# EAGLE board clonos (EAGLE 6.4), part 1 of 2
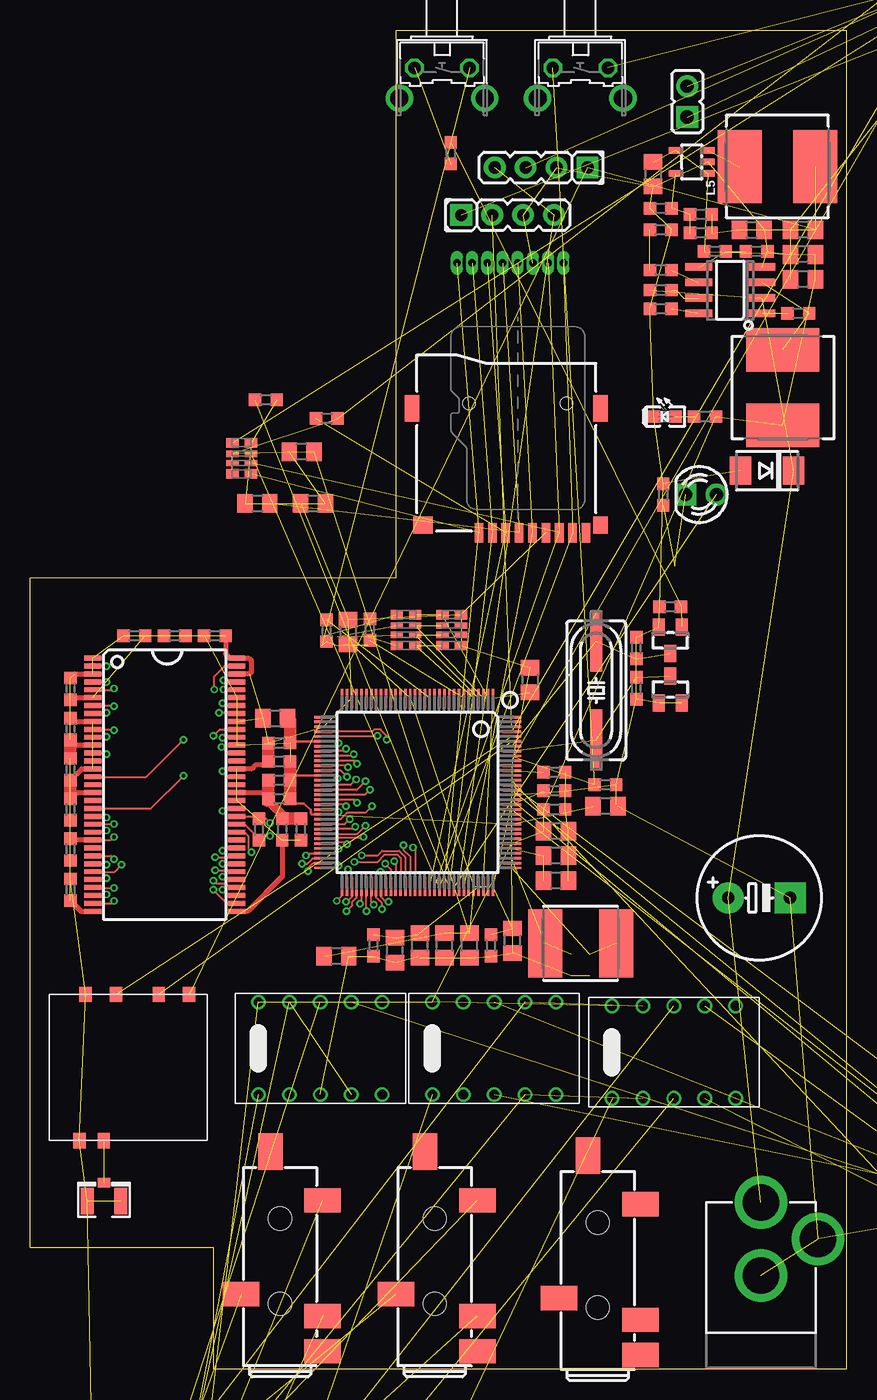
[diagram p6: board, top side]
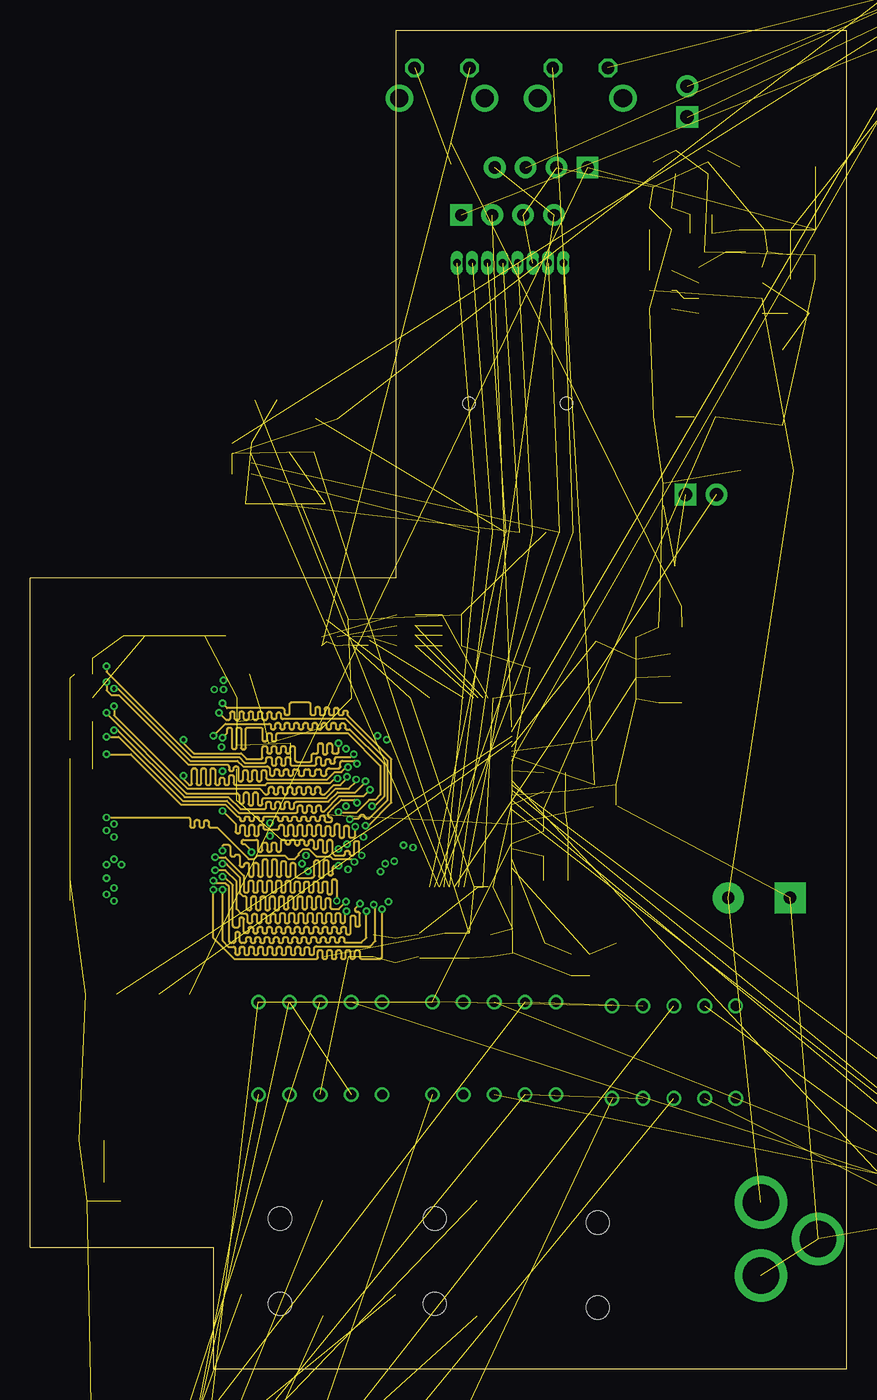
[diagram p7: board, inner layer Route2]
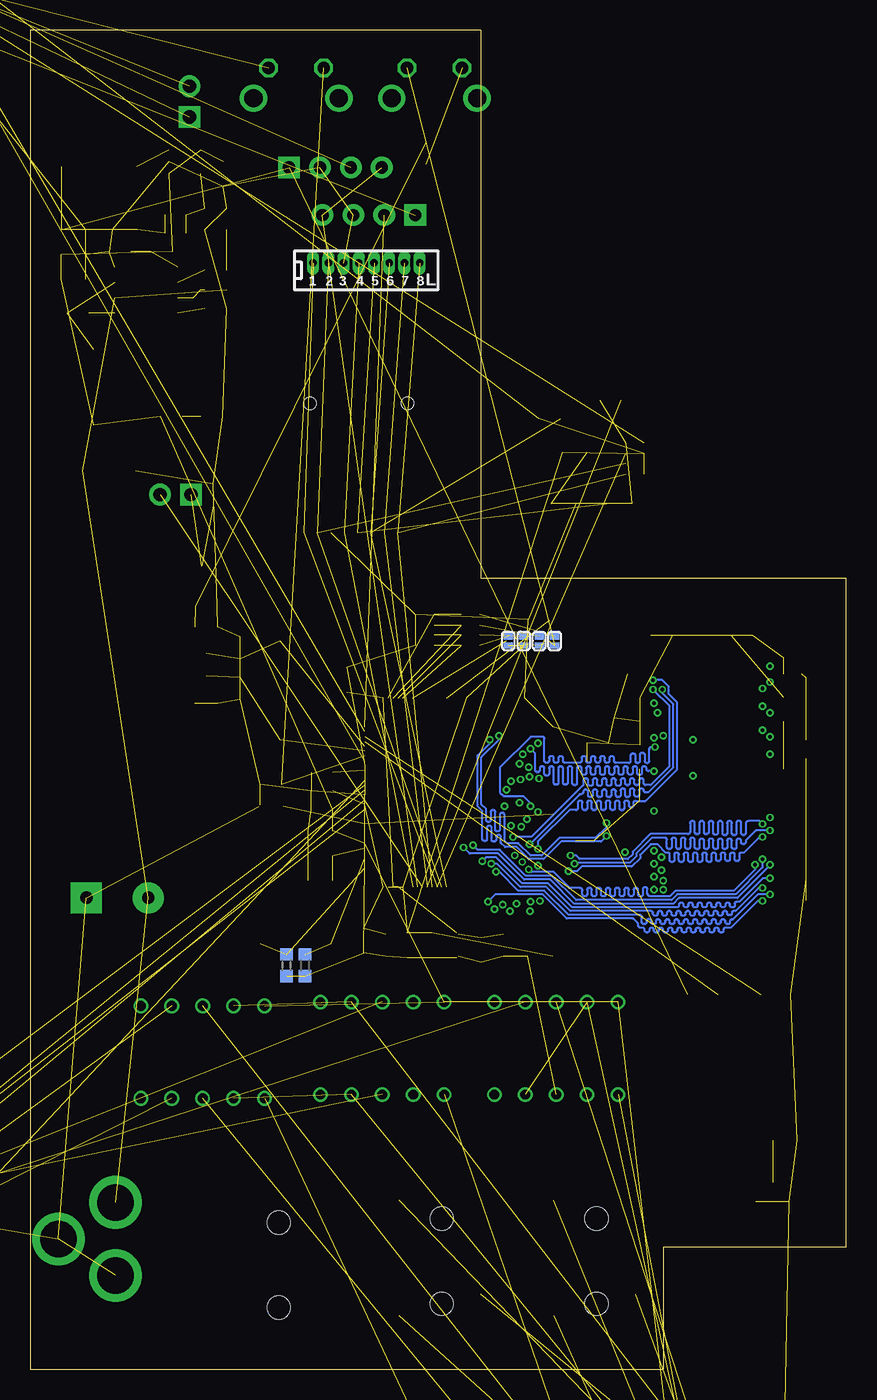
[diagram p8: board, bottom side, seen from below]

Size 67 x 110 mm. Coordinates in mm from the lower left corner, seen from the top.
Outline: 0,10 0,65 30,65 30,110 67,110 67,0 15,0 15,10 0,10
Copper layers (1*2*15*16): Top 0.035mm / dielectric 0.5mm / Route2 0.035mm / dielectric 0.5mm / Route15 0.035mm / dielectric 0.5mm / Bottom 0.035mm
Design rules "default": minimum track width 6mil, minimum drill 0.3mm, track to track 0.1499mm, track to pad 6mil, pad to pad 6mil, via to via 6mil, smd to smd 1mil, copper to edge 10mil, drill to drill 8mil, minimum pad ring 6mil, minimum via ring 6mil, stop-mask expansion 4mil, vias tented up to drill 25mil, thermal gap 12mil
Net classes: 1 PWR: width 0.203 mm, drill 0.4 mm, clearance 0.076 mm

## Footprints (pad centres in the part's own frame; a part is rotated, then mirrored left to right if it is on the bottom)
C0805_5MIL_DWS = smd 1.27 x 1.524: 1 -1.016,0; 2 1.016,0
C0603_DWS = smd 1.016 x 1.016: 1 -0.889,0; 2 0.889,0
E5-10,5 = drill 1.016 pad 2.54: + -2.54,0 | drill 1.016 pad 2.54 square: - 2.54,0
SJ_1_SMALLER = smd 0.508 x 0.762: 1 -0.381,0; 2 0.381,0
SOD-323F = smd 1 x 0.8: A -1,0; C 1,0
DO214AA = smd 1.778 x 2.286: A 2.177,0; C -2.177,0
SOT23C = smd 1 x 1.4: 1 -0.95,-1.1; 2 0.95,-1.1; 3 0,1.1
FB805 = smd 1.3 x 1.5: 1 -0.85,0; 2 0.85,0
PJ-W47S-05D2-LF_5PIN_V2 = smd 2 x 3: 1 2.1,-0.5; 2 14.5,-0.5; 3 6.8,6.2; 5 5,-0.5 | smd 3 x 2: 4 18.5,3.8 | hole 1.9: 6,3; 13,3
POWER_JACK_PTH = drill 2.997 pad 4.318: GND 0,7.7; GNDBREAK 4.7,10.7; PWR 0,13.7
WU08S = drill 0.6 pad 0.991 long: 1 -4.375,0; 2 -3.125,0; 3 -1.875,0; 4 -0.625,0; 5 0.625,0; 6 1.875,0; 7 3.125,0; 8 4.375,0
CD53 = smd 2.794 x 5.588: 1 -2.921,0; 2 2.921,0
8X8MM_3131 = smd 3.6 x 6: 1 -3.1,0; 2 3.1,0
L0805_5MIL_DWS = smd 1.27 x 1.524: 1 -1.016,0; 2 1.016,0
LED-3.0MM = drill 1.092 pad 1.778: A -1.27,0 | drill 1.092 pad 1.778 square: K 1.27,0
B3F-31XX = drill 1.016 octagon: 1 -2.261,-1.245; 2 2.261,-1.245 | drill 1.499 pad 2.159: 3 -3.505,1.245; 4 3.505,1.245
LED-0603 = smd 1.016 x 1.016: A 0.889,0; C -0.889,0
HC49/SMD2_THIN = smd 5 x 1: 1 -4.064,0; 2 4.064,0
R0603_5MIL_DWS = smd 1.016 x 1.016: 1 -0.889,0; 2 0.889,0
R0603_5MIL_DWS_NA = smd 1.016 x 1.016: 1 -0.889,0; 2 0.889,0
JP1 = drill 1.1 pad 1.778 square: 1 0,-1.27 | drill 1.1 pad 1.778: 2 0,1.27
A5W-K = drill 0.8: COIL+ 0,7.62; COIL- 0.002,0.021; COM1 5.08,7.62; COM2 5.082,0.021; DNC1 10.16,7.62; DNC2 10.162,0.021; NC1 2.54,7.62; NC2 2.542,0.021; NO1 7.62,7.62; NO2 7.622,0.021
R_MATRIX_4 = smd 1.016 x 0.762: 1.1 -0.762,1.27; 1.2 0.762,1.27; 4.1 -0.762,-1.27; 4.2 0.762,-1.27 | smd 1.016 x 0.508: 2.1 -0.762,0.381; 2.2 0.762,0.381; 3.1 -0.762,-0.381; 3.2 0.762,-0.381
TFC-WPAPR-08 = smd 0.7 x 1.6: 1 -3.2,-0.125; 2 -2.1,-0.125; 3 -1,-0.125; 4 0.1,-0.125; 5 1.2,-0.125; 6 2.3,-0.125; 7 3.4,-0.125; 8 4.5,-0.125; 9 5.6,-0.125 | smd 1.2 x 1.4: 10 6.8,0.5 | smd 1.6 x 1.4: 11 -7.8,0.5 | smd 1.2 x 2.2: 12 6.8,10.1; 13 -8.7,10.1 | hole 1: 4,10.5; -4,10.5
HN1X4 = drill 1 pad 1.778 square: 1 -3.81,0 | drill 1 pad 1.778: 2 -1.27,0; 3 1.27,0; 4 3.81,0
SOT23 = smd 1 x 1.4: 1 -0.95,-1.1; 2 0.95,-1.1; 3 0,1.1
TQFP128LD = smd 0.2 x 1.5: 1 -6.2,-7.75; 2 -5.8,-7.75; 3 -5.4,-7.75; 4 -5,-7.75; 5 -4.6,-7.75; 6 -4.2,-7.75; 7 -3.8,-7.75; 8 -3.4,-7.75; 9 -3,-7.75; 10 -2.6,-7.75; 11 -2.2,-7.75; 12 -1.8,-7.75; 13 -1.4,-7.75; 14 -1,-7.75; 15 -0.6,-7.75; 16 -0.2,-7.75; 17 0.2,-7.75; 18 0.6,-7.75; 19 1,-7.75; 20 1.4,-7.75; 21 1.8,-7.75; 22 2.2,-7.75; 23 2.6,-7.75; 24 3,-7.75; 25 3.4,-7.75; 26 3.8,-7.75; 27 4.2,-7.75; 28 4.6,-7.75; 29 5,-7.75; 30 5.4,-7.75; 31 5.8,-7.75; 32 6.2,-7.75; 65 6.2,7.75; 66 5.8,7.75; 67 5.4,7.75; 68 5,7.75; 69 4.6,7.75; 70 4.2,7.75; 71 3.8,7.75; 72 3.4,7.75; 73 3,7.75; 74 2.6,7.75; 75 2.2,7.75; 76 1.8,7.75; 77 1.4,7.75; 78 1,7.75; 79 0.6,7.75; 80 0.2,7.75; 81 -0.2,7.75; 82 -0.6,7.75; 83 -1,7.75; 84 -1.4,7.75; 85 -1.8,7.75; 86 -2.2,7.75; 87 -2.6,7.75; 88 -3,7.75; 89 -3.4,7.75; 90 -3.8,7.75; 91 -4.2,7.75; 92 -4.6,7.75; 93 -5,7.75; 94 -5.4,7.75; 95 -5.8,7.75; 96 -6.2,7.75 | smd 1.5 x 0.2: 33 7.75,-6.2; 34 7.75,-5.8; 35 7.75,-5.4; 36 7.75,-5; 37 7.75,-4.6; 38 7.75,-4.2; 39 7.75,-3.8; 40 7.75,-3.4; 41 7.75,-3; 42 7.75,-2.6; 43 7.75,-2.2; 44 7.75,-1.8; 45 7.75,-1.4; 46 7.75,-1; 47 7.75,-0.6; 48 7.75,-0.2; 49 7.75,0.2; 50 7.75,0.6; 51 7.75,1; 52 7.75,1.4; 53 7.75,1.8; 54 7.75,2.2; 55 7.75,2.6; 56 7.75,3; 57 7.75,3.4; 58 7.75,3.8; 59 7.75,4.2; 60 7.75,4.6; 61 7.75,5; 62 7.75,5.4; 63 7.75,5.8; 64 7.75,6.2; 97 -7.75,6.2; 98 -7.75,5.8; 99 -7.75,5.4; 100 -7.75,5; 101 -7.75,4.6; 102 -7.75,4.2; 103 -7.75,3.8; 104 -7.75,3.4; 105 -7.75,3; 106 -7.75,2.6; 107 -7.75,2.2; 108 -7.75,1.8; 109 -7.75,1.4; 110 -7.75,1; 111 -7.75,0.6; 112 -7.75,0.2; 113 -7.75,-0.2; 114 -7.75,-0.6; 115 -7.75,-1; 116 -7.75,-1.4; 117 -7.75,-1.8; 118 -7.75,-2.2; 119 -7.75,-2.6; 120 -7.75,-3; 121 -7.75,-3.4; 122 -7.75,-3.8; 123 -7.75,-4.2; 124 -7.75,-4.6; 125 -7.75,-5; 126 -7.75,-5.4; 127 -7.75,-5.8; 128 -7.75,-6.2
66TSOP-II = smd 0.4 x 1.4: 1 -10.4,-5.925; 2 -9.75,-5.925; 3 -9.1,-5.925; 4 -8.45,-5.925; 5 -7.8,-5.925; 6 -7.15,-5.925; 7 -6.5,-5.925; 8 -5.85,-5.925; 9 -5.2,-5.925; 10 -4.55,-5.925; 11 -3.9,-5.925; 12 -3.25,-5.925; 13 -2.6,-5.925; 14 -1.95,-5.925; 15 -1.3,-5.925; 16 -0.65,-5.925; 17 0,-5.925; 18 0.65,-5.925; 19 1.3,-5.925; 20 1.95,-5.925; 21 2.6,-5.925; 22 3.25,-5.925; 23 3.9,-5.925; 24 4.55,-5.925; 25 5.2,-5.925; 26 5.85,-5.925; 27 6.5,-5.925; 28 7.15,-5.925; 29 7.8,-5.925; 30 8.45,-5.925; 31 9.1,-5.925; 32 9.75,-5.925; 33 10.4,-5.925; 34 10.4,5.925; 35 9.75,5.925; 36 9.1,5.925; 37 8.45,5.925; 38 7.8,5.925; 39 7.15,5.925; 40 6.5,5.925; 41 5.85,5.925; 42 5.2,5.925; 43 4.55,5.925; 44 3.9,5.925; 45 3.25,5.925; 46 2.6,5.925; 47 1.95,5.925; 48 1.3,5.925; 49 0.65,5.925; 50 0,5.925; 51 -0.65,5.925; 52 -1.3,5.925; 53 -1.95,5.925; 54 -2.6,5.925; 55 -3.25,5.925; 56 -3.9,5.925; 57 -4.55,5.925; 58 -5.2,5.925; 59 -5.85,5.925; 60 -6.5,5.925; 61 -7.15,5.925; 62 -7.8,5.925; 63 -8.45,5.925; 64 -9.1,5.925; 65 -9.75,5.925; 66 -10.4,5.925
SOIC8 = smd 0.6 x 2.2: 1 -1.905,-2.6; 2 -0.635,-2.6; 3 0.635,-2.6; 4 1.905,-2.6; 5 1.905,2.6; 6 0.635,2.6; 7 -0.635,2.6; 8 -1.905,2.6
SOT23-5 = smd 0.55 x 1.2: 1 -0.95,-1.3; 2 0,-1.3; 3 0.95,-1.3; 4 0.95,1.3; 5 -0.95,1.3
RTL8188ETV = smd 1 x 1.27: ANT 8.5,12; GND 10,0; GND2 10.5,12; UDM 4,0; UDP 7.5,0; VCC 1.5,0
U.FL = smd 2.2 x 1.05: 1 0,1.375; 2 0,-1.375 | smd 0.8 x 1: 3 1.525,0

## Placement (x,y rotation side)
C1  22uF/6.3V  [C0805_5MIL_DWS]  41.03,56.63 270 top
C2  22uF/6.3V  [C0805_5MIL_DWS]  29.96,34.43 90 top
C3  22uF/6.3V  [C0805_5MIL_DWS]  26.1,60.57 270 top
C4  22uF/6.3V  [C0805_5MIL_DWS]  25.13,33.92 180 top
C5  22uF/6.3V  [C0805_5MIL_DWS]  20.1,53.48 0 top
C6  100nF  [C0603_DWS]  20.43,51.45 0 top
C7  100nF  [C0603_DWS]  20.43,49.92 0 top
C8  22uF/6.3V  [C0805_5MIL_DWS]  47.23,46.24 180 top
C9  22uF/6.3V  [C0805_5MIL_DWS]  43.17,40.15 180 top
C10  22uF/6.3V  [C0805_5MIL_DWS]  43.17,42.18 180 top
C11  22uF/6.3V  [C0805_5MIL_DWS]  43.17,44.21 180 top
C12  100nF  [C0603_DWS]  43.04,45.99 180 top
C13  22uF/6.3V  [C0805_5MIL_DWS]  31.99,34.81 90 top
C14  100nF  [C0603_DWS]  28.18,34.81 90 top
C15  22uF/6.3V  [C0805_5MIL_DWS]  34.02,34.81 90 top
C16  22uF/6.3V  [C0805_5MIL_DWS]  36.05,34.81 90 top
C17  22uF/6.3V  [C0805_5MIL_DWS]  39.61,35.19 90 top
C18  100nF  [C0603_DWS]  37.83,34.81 90 top
C22  100nF  [C0603_DWS]  47.23,48.02 180 top
C23  10pF  [C0603_DWS]  49.77,59.25 270 top
C24  10pF  [C0603_DWS]  49.77,55.94 90 top
C25  100nF  [C0603_DWS]  43.04,47.51 180 top
C26  1uF  [C0603_DWS]  43.04,49.04 180 top
C27  1uF  [C0603_DWS]  72.94,13.54 270 top  (outside the outline)
C28  1uF  [C0603_DWS]  82.39,15.24 0 top  (outside the outline)
C29  22uF/6.3V  [C0805_5MIL_DWS]  23.21,71.13 0 top
C30  100nF  [C0603_DWS]  8.55,60.26 180 top
C31  100nF  [C0603_DWS]  3.29,45.99 90 top
C32  100nF  [C0603_DWS]  3.29,39.38 270 top
C33  100nF  [C0603_DWS]  3.29,55.89 90 top
C34  100nF  [C0603_DWS]  3.29,52.59 90 top
C35  10uF/10V  [C0603_DWS]  3.29,49.29 270 top
C36  100nF  [C0603_DWS]  11.85,60.26 180 top
C37  10uF/10V  [C0603_DWS]  15.15,60.26 180 top
C38  100nF  [C0603_DWS]  20.43,48.4 180 top
C39  100nF  [C0603_DWS]  20.69,44.34 90 top
C40  100nF  [C0603_DWS]  76.19,109.83 180 top  (outside the outline)
C68  470uF/25V/LOWESR/105C  [E5-10,5]  59.87,38.72 0 top
C69  100nF  [C0603_DWS]  51.78,87.13 180 top
C70  10nF  [C0603_DWS]  63.08,86.75 0 top
C71  3.3nF  [C0603_DWS]  51.78,90.31 180 top
C72  22uF/6.3V  [C0805_5MIL_DWS]  63.46,91.58 180 top
C73  22uF/6.3V  [C0805_5MIL_DWS]  51.14,98.18 270 top
C74  22pF  [C0603_DWS]  55.08,93.35 180 top
C75  22uF/6.3V  [C0805_5MIL_DWS]  63.46,93.61 180 top
C79  22uF/6.3V  [C0805_5MIL_DWS]  63.46,89.54 180 top
C80  22uF/6.3V  [C0805_5MIL_DWS]  59.25,93.61 0 top
C81  22uF/6.3V  [C0805_5MIL_DWS]  18.64,71.13 0 top
C82  NA  [C0603_DWS]  45.96,33.19 90 bottom
C83  100pF  [C0603_DWS]  44.44,33.19 90 bottom
D00_H  Close  [SJ_1_SMALLER]  23.94,59.83 270 bottom
D1  1N4148  [SOD-323F]  5,-80 0 top  (outside the outline)
D01_H  Open  [SJ_1_SMALLER]  25.21,59.83 270 bottom
D2  1N4148  [SOD-323F]  5,-85 0 top  (outside the outline)
D02_H  Open  [SJ_1_SMALLER]  26.48,59.83 270 bottom
D3  SMBJ16A  [DO214AA]  60.52,73.82 180 top
D03_H  Close  [SJ_1_SMALLER]  27.75,59.83 270 bottom
D4  BAT54C  [SOT23C]  72.77,108.59 0 top  (outside the outline)
D5  1N4148  [SOD-323F]  5,-90 0 top  (outside the outline)
FB1  HZ0805D152R  [FB805]  5,-15 0 top  (outside the outline)
FB2  HZ0805D152R  [FB805]  5,-20 0 top  (outside the outline)
FB3  HZ0805D152R  [FB805]  5,-25 0 top  (outside the outline)
FB4  HZ0805D152R  [FB805]  5,-30 0 top  (outside the outline)
FB5  HZ0805D152R  [FB805]  5,-35 0 top  (outside the outline)
FB6  HZ0805D152R  [FB805]  5,-40 0 top  (outside the outline)
HEADPHONES  AUDIO_JACK_5PINPJ-W47S-05D2-LF_V2  [PJ-W47S-05D2-LF_5PIN_V2]  36.21,-0.64 90 top
HEADPHONES1  AUDIO_JACK_5PINPJ-W47S-05D2-LF_V2  [PJ-W47S-05D2-LF_5PIN_V2]  49.6,-0.95 90 top
J1  POWER_JACKPTH  [POWER_JACK_PTH]  60,0 0 top
JTAG  NA(WU08S)  [WU08S]  39.4,90.89 0 bottom
L1  22uH/1.3A/SW68  [CD53]  45.2,34.99 0 top
L2  10uH/2.3A/YS75/7x8  [8X8MM_3131]  61.81,80.65 270 top
L5  2.2uH/3A/YS75/7x8  [8X8MM_3131]  61.35,98.81 0 top
L6  CL470nH/0805/1.76R/250mA  [L0805_5MIL_DWS]  22.28,75.37 180 top
LED1  LED/GREEN/3MM  [LED-3.0MM]  55.08,71.86 180 top
LINE_IN  AUDIO_JACK_5PINPJ-W47S-05D2-LF_V2  [PJ-W47S-05D2-LF_5PIN_V2]  23.51,-0.64 90 top
LOGO1  OSHW-LOGOS  [OSHW-LOGO-S]  75,39.76 0 top  (outside the outline)
PWR_BUT  TV-06B  [B3F-31XX]  45.17,105.67 180 top
PWR_LED  LED/RED/0603  [LED-0603]  52.11,78.27 0 top
Q1  HC49/S1  [HC49/SMD2_THIN]  46.47,55.77 90 top
R1  4.7k  [R0603_5MIL_DWS]  71.11,112.62 90 top  (outside the outline)
R2  560R  [R0603_5MIL_DWS]  51.98,71.86 270 top
R3  120R  [R0603_5MIL_DWS]  82,13.72 180 top  (outside the outline)
R4  120R  [R0603_5MIL_DWS]  81.75,12.45 0 top  (outside the outline)
R5  10k  [R0603_5MIL_DWS]  74.46,13.54 270 top  (outside the outline)
R6  10k  [R0603_5MIL_DWS]  79.04,13.54 270 top  (outside the outline)
R7  4.7k  [R0603_5MIL_DWS]  77.51,13.54 90 top  (outside the outline)
R8  4.7k  [R0603_5MIL_DWS]  75.99,13.54 90 top  (outside the outline)
R9  47k  [R0603_5MIL_DWS]  34.52,99.91 270 top
R10  47k  [R0603_5MIL_DWS]  52.56,62.65 180 top
R11  1k  [R0603_5MIL_DWS]  5,-100 0 top  (outside the outline)
R14  NA(47k)  [R0603_5MIL_DWS]  27.88,60.77 270 top
R15  47k  [R0603_5MIL_DWS]  24.32,60.67 90 top
R16  10k  [R0603_5MIL_DWS]  3.29,42.69 270 top
R17  120R  [R0603_5MIL_DWS]  18.78,44.34 270 top
R18  1k/1%  [R0603_5MIL_DWS]  20.43,46.88 0 top
R19  1k/1%  [R0603_5MIL_DWS]  22.21,44.34 90 top
R20  1M  [R0603_5MIL_DWS]  19.34,79.64 0 top
R21  10k  [R0603_5MIL_DWS]  24.34,78.11 0 top
R22  1k  [R0603_5MIL_DWS]  55.41,78.27 180 top
R23  1k  [R0603_5MIL_DWS]  75.17,113.13 90 top  (outside the outline)
R24  1k  [R0603_5MIL_DWS]  76.69,113.13 90 top  (outside the outline)
R25  10k  [R0603_5MIL_DWS_NA]  73.65,113.13 90 top  (outside the outline)
R42  47k  [R0603_5MIL_DWS]  51.78,88.66 0 top
R43  2.2k  [R0603_5MIL_DWS]  51.78,93.61 0 top
R44  1.1k/1%  [R0603_5MIL_DWS]  59.65,91.83 0 top
R45  4.99k/1%  [R0603_5MIL_DWS]  56.22,91.83 180 top
R47  4.99k/1%  [R0603_5MIL_DWS]  55.08,94.88 180 top
R48  1.1k/1%  [R0603_5MIL_DWS]  51.78,95.39 180 top
REC  NA(HN1x2)  [JP1]  53.95,104.15 0 top
REL1  A5W-K-BIS  [A5W-K]  18.73,22.54 0 top
REL2  A5W-K-BIS  [A5W-K]  33.02,22.54 0 top
REL3  A5W-K-BIS  [A5W-K]  47.77,22.23 0 top
RESET  TV-06B  [B3F-31XX]  33.81,105.67 180 top
RM1  RA1206_(4X0603)_4B8_100K  [R_MATRIX_4]  17.36,74.83 180 top
RM2  RA1206_(4X0603)_4B8_47K  [R_MATRIX_4]  34.61,60.72 180 top
RM3  RA1206_(4X0603)_4B8_4.7K  [R_MATRIX_4]  30.85,60.72 180 top
SD  MICRO_SD/MMC_CP_NEWTFC-WPAPR-08  [TFC-WPAPR-08]  40.04,68.84 0 top
SJTAG  (NA)HN1X4  [HN1X4]  41.95,98.73 180 top
T1  BC846B  [SOT23]  52.56,55.84 0 top
T2  BC846B  [SOT23]  52.56,59.88 180 top
T3  BC846B  [SOT23]  5,-50 0 top  (outside the outline)
T4  BC846B  [SOT23]  5,-60 0 top  (outside the outline)
T5  BC846B  [SOT23]  5,-70 0 top  (outside the outline)
U1  MCIMX233CAG4C  [TQFP128LD]  31.8,47.38 180 top
U2  HY5DU121622D(L)T(P)-J  [66TSOP-II]  11.04,48.02 270 top
U5  MP1482DS  [SOIC8]  57.49,88.66 90 top
U6  SY8008C(AA)C  [SOT23-5]  54.32,99.2 90 top
U$1  RTL8188ETV  [RTL8188ETV]  14.53,30.79 180 top
U$5  [LOGO-OPENHARDWARE_8X8]  77.57,49.77 0 bottom  (outside the outline)
U$10  [ESD_SYMBOL]  81.13,24.84 0 bottom  (outside the outline)
U$11  [RECYCLE_BIN1/8]  83.38,35.73 0 bottom  (outside the outline)
U_DEBUG  HN1X4  [HN1X4]  39.2,94.83 0 top
X1  [U.FL]  6.04,13.8 90 top